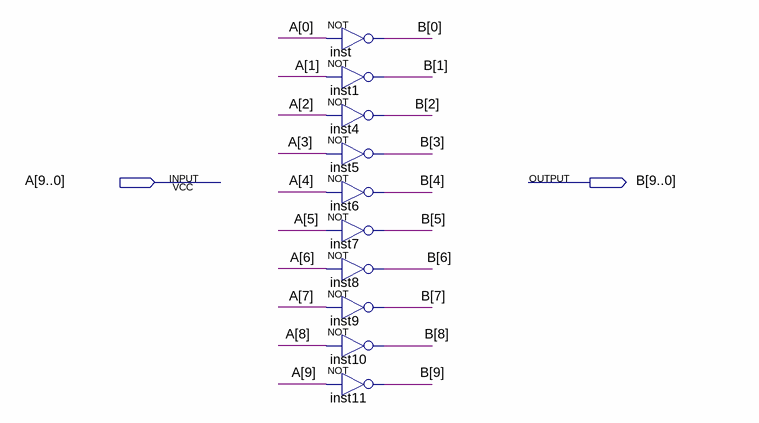
[diagram p0: schematic sheet]
// Quartus schematic not_10.bdf as structural Verilog: 10 symbols, 2 pins
module not_10 (
  input  [9:0] A,
  output [9:0] B
);

  not inst (B[0], A[0]);
  not inst1 (B[1], A[1]);
  not inst4 (B[2], A[2]);
  not inst5 (B[3], A[3]);
  not inst6 (B[4], A[4]);
  not inst7 (B[5], A[5]);
  not inst8 (B[6], A[6]);
  not inst9 (B[7], A[7]);
  not inst10 (B[8], A[8]);
  not inst11 (B[9], A[9]);
endmodule
